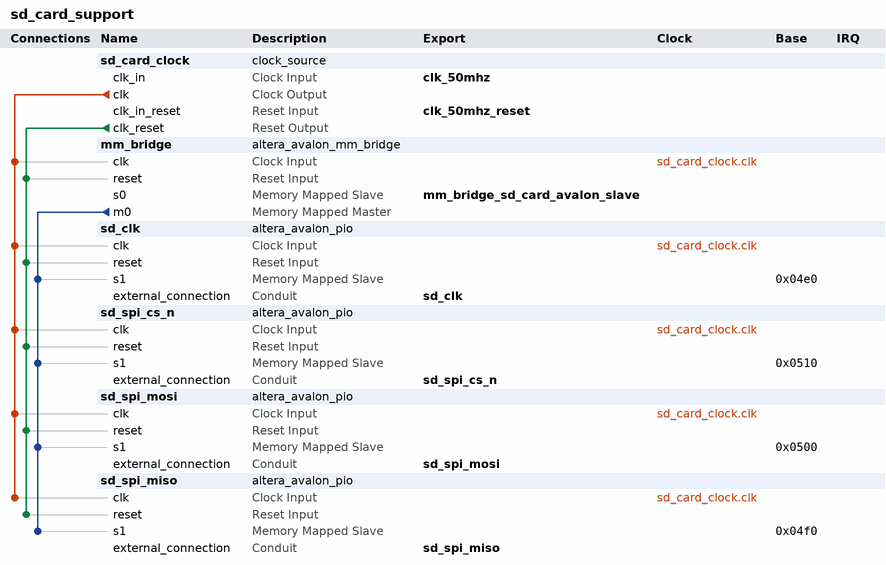
[diagram p0: system contents]
# Platform Designer (Qsys) system sd_card_support, Stratix IV EP4SGX530KH40C2
# Parameters at their usual value, and those the tool derives, are not listed.
package require -exact qsys 14.1
create_system sd_card_support
set_project_property DEVICE_FAMILY {Stratix IV}
set_project_property DEVICE EP4SGX530KH40C2

add_instance sd_card_clock clock_source 14.1
set_instance_parameter_value sd_card_clock clockFrequency 50000000
set_instance_parameter_value sd_card_clock resetSynchronousEdges BOTH

add_instance mm_bridge altera_avalon_mm_bridge 14.1
set_instance_parameter_value mm_bridge ADDRESS_UNITS SYMBOLS
set_instance_parameter_value mm_bridge ADDRESS_WIDTH 27
set_instance_parameter_value mm_bridge DATA_WIDTH 32
set_instance_parameter_value mm_bridge MAX_PENDING_RESPONSES 4
set_instance_parameter_value mm_bridge USE_AUTO_ADDRESS_WIDTH 1

add_instance sd_clk altera_avalon_pio 14.1
set_instance_parameter_value sd_clk direction Output
set_instance_parameter_value sd_clk width 1

add_instance sd_spi_cs_n altera_avalon_pio 14.1
set_instance_parameter_value sd_spi_cs_n direction Output
set_instance_parameter_value sd_spi_cs_n resetValue 1
set_instance_parameter_value sd_spi_cs_n width 1

add_instance sd_spi_mosi altera_avalon_pio 14.1
set_instance_parameter_value sd_spi_mosi direction Output
set_instance_parameter_value sd_spi_mosi resetValue 1
set_instance_parameter_value sd_spi_mosi width 1

add_instance sd_spi_miso altera_avalon_pio 14.1
set_instance_parameter_value sd_spi_miso direction Input
set_instance_parameter_value sd_spi_miso width 1

# connections
add_connection sd_card_clock.clk mm_bridge.clk clock
add_connection sd_card_clock.clk sd_clk.clk clock
add_connection sd_card_clock.clk sd_spi_cs_n.clk clock
add_connection sd_card_clock.clk sd_spi_miso.clk clock
add_connection sd_card_clock.clk sd_spi_mosi.clk clock
add_connection sd_card_clock.clk_reset mm_bridge.reset reset
add_connection sd_card_clock.clk_reset sd_clk.reset reset
add_connection sd_card_clock.clk_reset sd_spi_cs_n.reset reset
add_connection sd_card_clock.clk_reset sd_spi_miso.reset reset
add_connection sd_card_clock.clk_reset sd_spi_mosi.reset reset
add_connection mm_bridge.m0 sd_clk.s1 avalon
set_connection_parameter_value mm_bridge.m0/sd_clk.s1 baseAddress 0x04e0
add_connection mm_bridge.m0 sd_spi_cs_n.s1 avalon
set_connection_parameter_value mm_bridge.m0/sd_spi_cs_n.s1 baseAddress 0x0510
add_connection mm_bridge.m0 sd_spi_miso.s1 avalon
set_connection_parameter_value mm_bridge.m0/sd_spi_miso.s1 baseAddress 0x04f0
add_connection mm_bridge.m0 sd_spi_mosi.s1 avalon
set_connection_parameter_value mm_bridge.m0/sd_spi_mosi.s1 baseAddress 0x0500

# exported interfaces
add_interface clk_50mhz clock sink
set_interface_property clk_50mhz EXPORT_OF sd_card_clock.clk_in
add_interface clk_50mhz_reset reset sink
set_interface_property clk_50mhz_reset EXPORT_OF sd_card_clock.clk_in_reset
add_interface mm_bridge_sd_card_avalon_slave avalon slave
set_interface_property mm_bridge_sd_card_avalon_slave EXPORT_OF mm_bridge.s0
add_interface sd_clk conduit end
set_interface_property sd_clk EXPORT_OF sd_clk.external_connection
add_interface sd_spi_cs_n conduit end
set_interface_property sd_spi_cs_n EXPORT_OF sd_spi_cs_n.external_connection
add_interface sd_spi_miso conduit end
set_interface_property sd_spi_miso EXPORT_OF sd_spi_miso.external_connection
add_interface sd_spi_mosi conduit end
set_interface_property sd_spi_mosi EXPORT_OF sd_spi_mosi.external_connection

set_interconnect_requirement {$system} qsys_mm.clockCrossingAdapter AUTO
set_interconnect_requirement {$system} qsys_mm.maxAdditionalLatency 1

save_system sd_card_support.qsys
